# EasyEDA Pro project ProPrj_超级电容V1.1-正式版.epro, schematic Schematic1, sheets 1 to 3 of 8

## Sheets
1 电源: Create Date: 2024-03-25; Page Name: 电源; Project Name: 超级电容V1.1-正式版; Schematic Name: Schematic1; Update Date: 2024-04-20; Company: 嘉立创EDA; Drawed: Welt; Page Size: A4; Version: V1.0
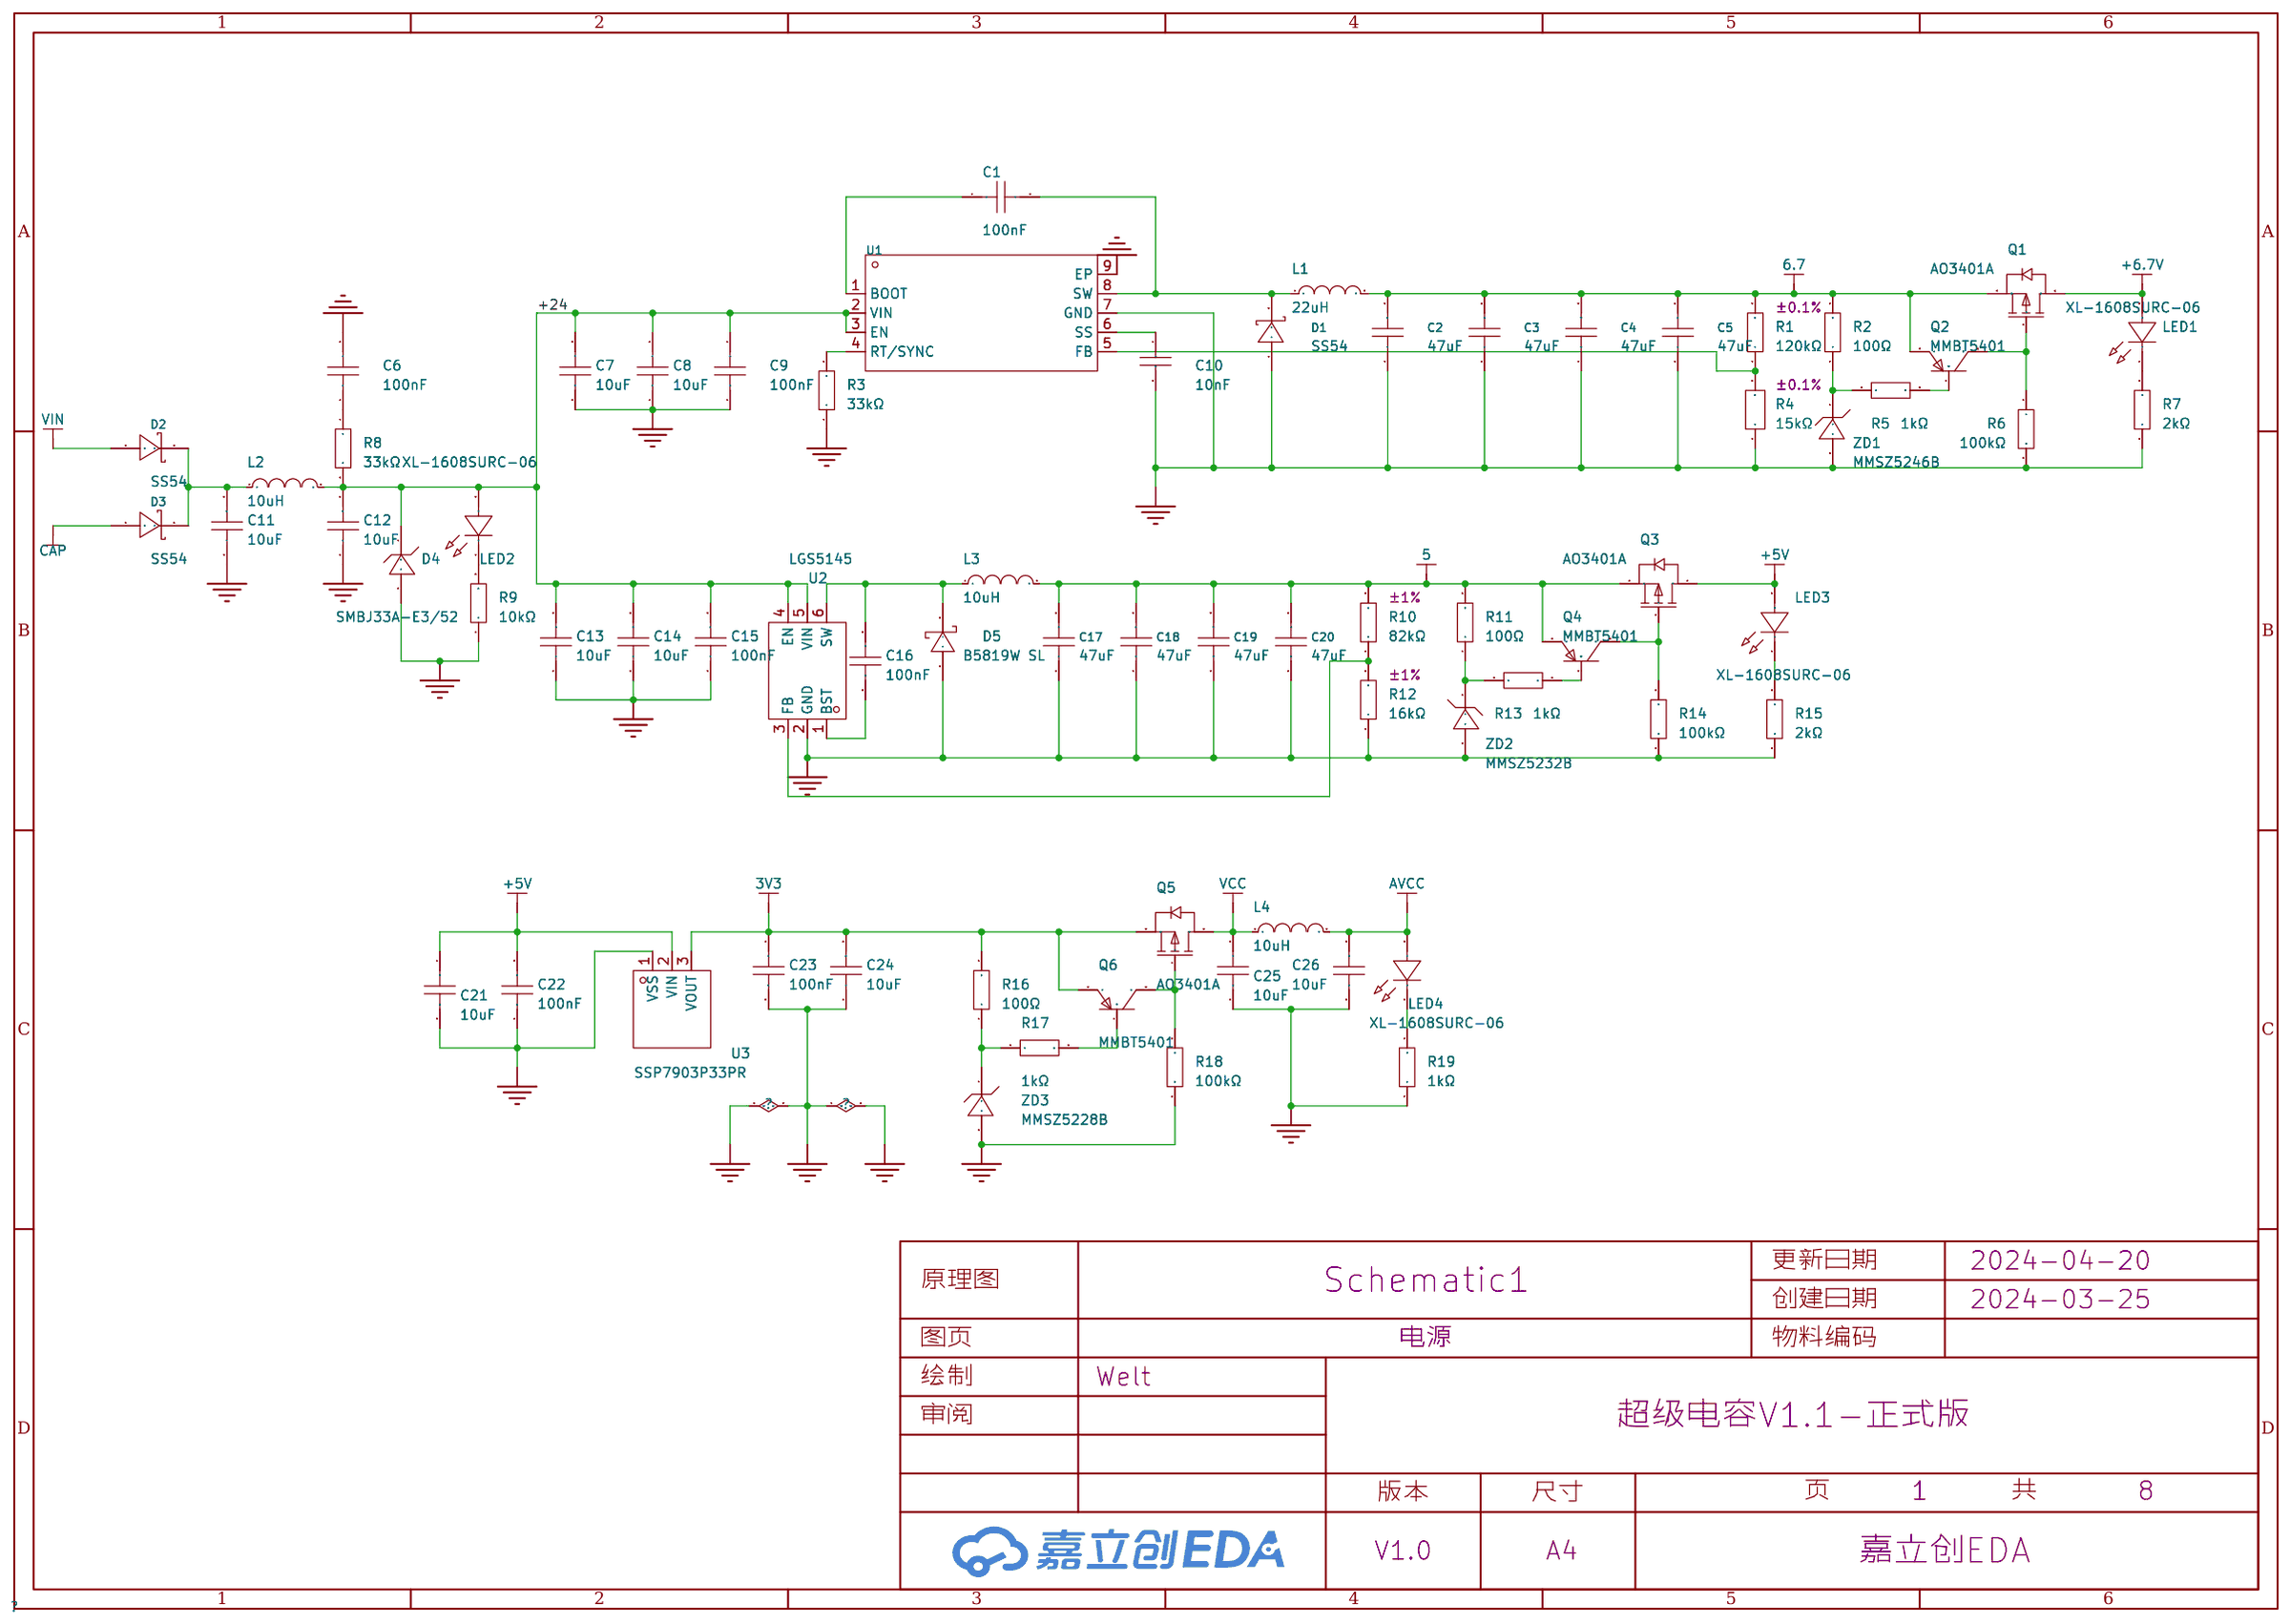
[diagram p0: 电源]
2 8708核心区: Page Name: 8708核心区; Project Name: 超级电容V1.0-样板; Update Date: 2024-04-18
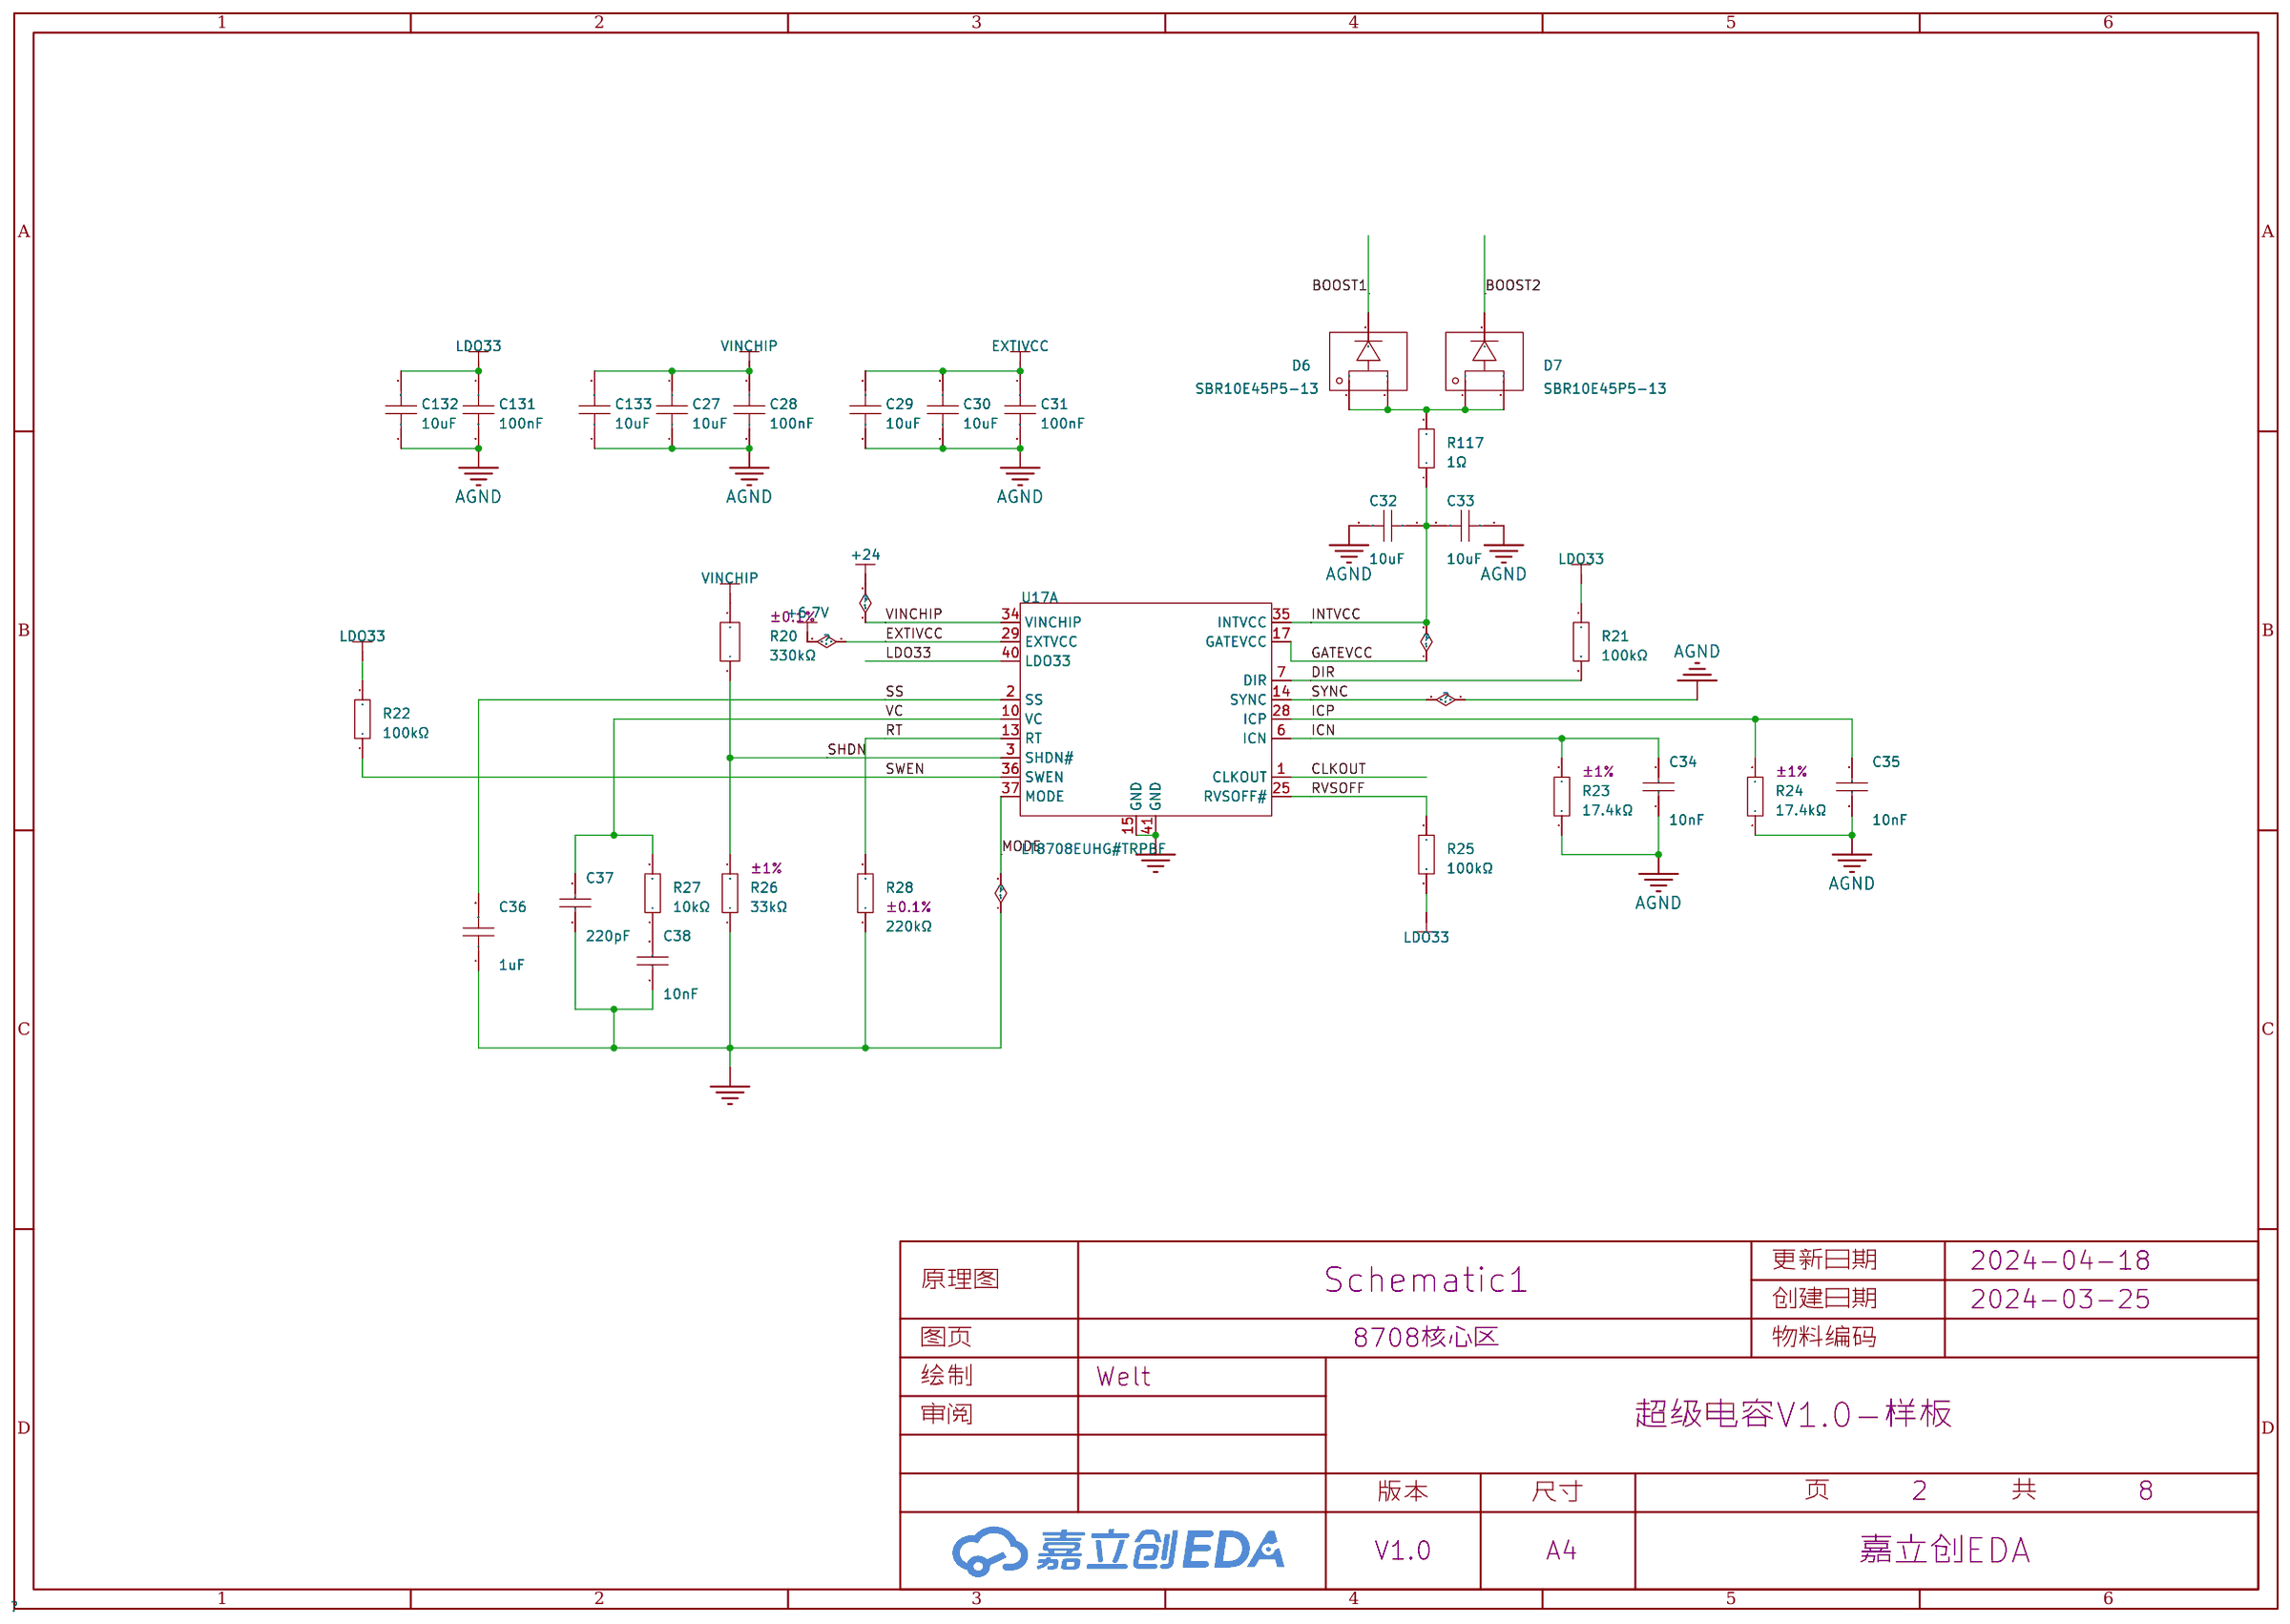
[diagram p1: 8708核心区]
3 功率通道: Page Name: 功率通道
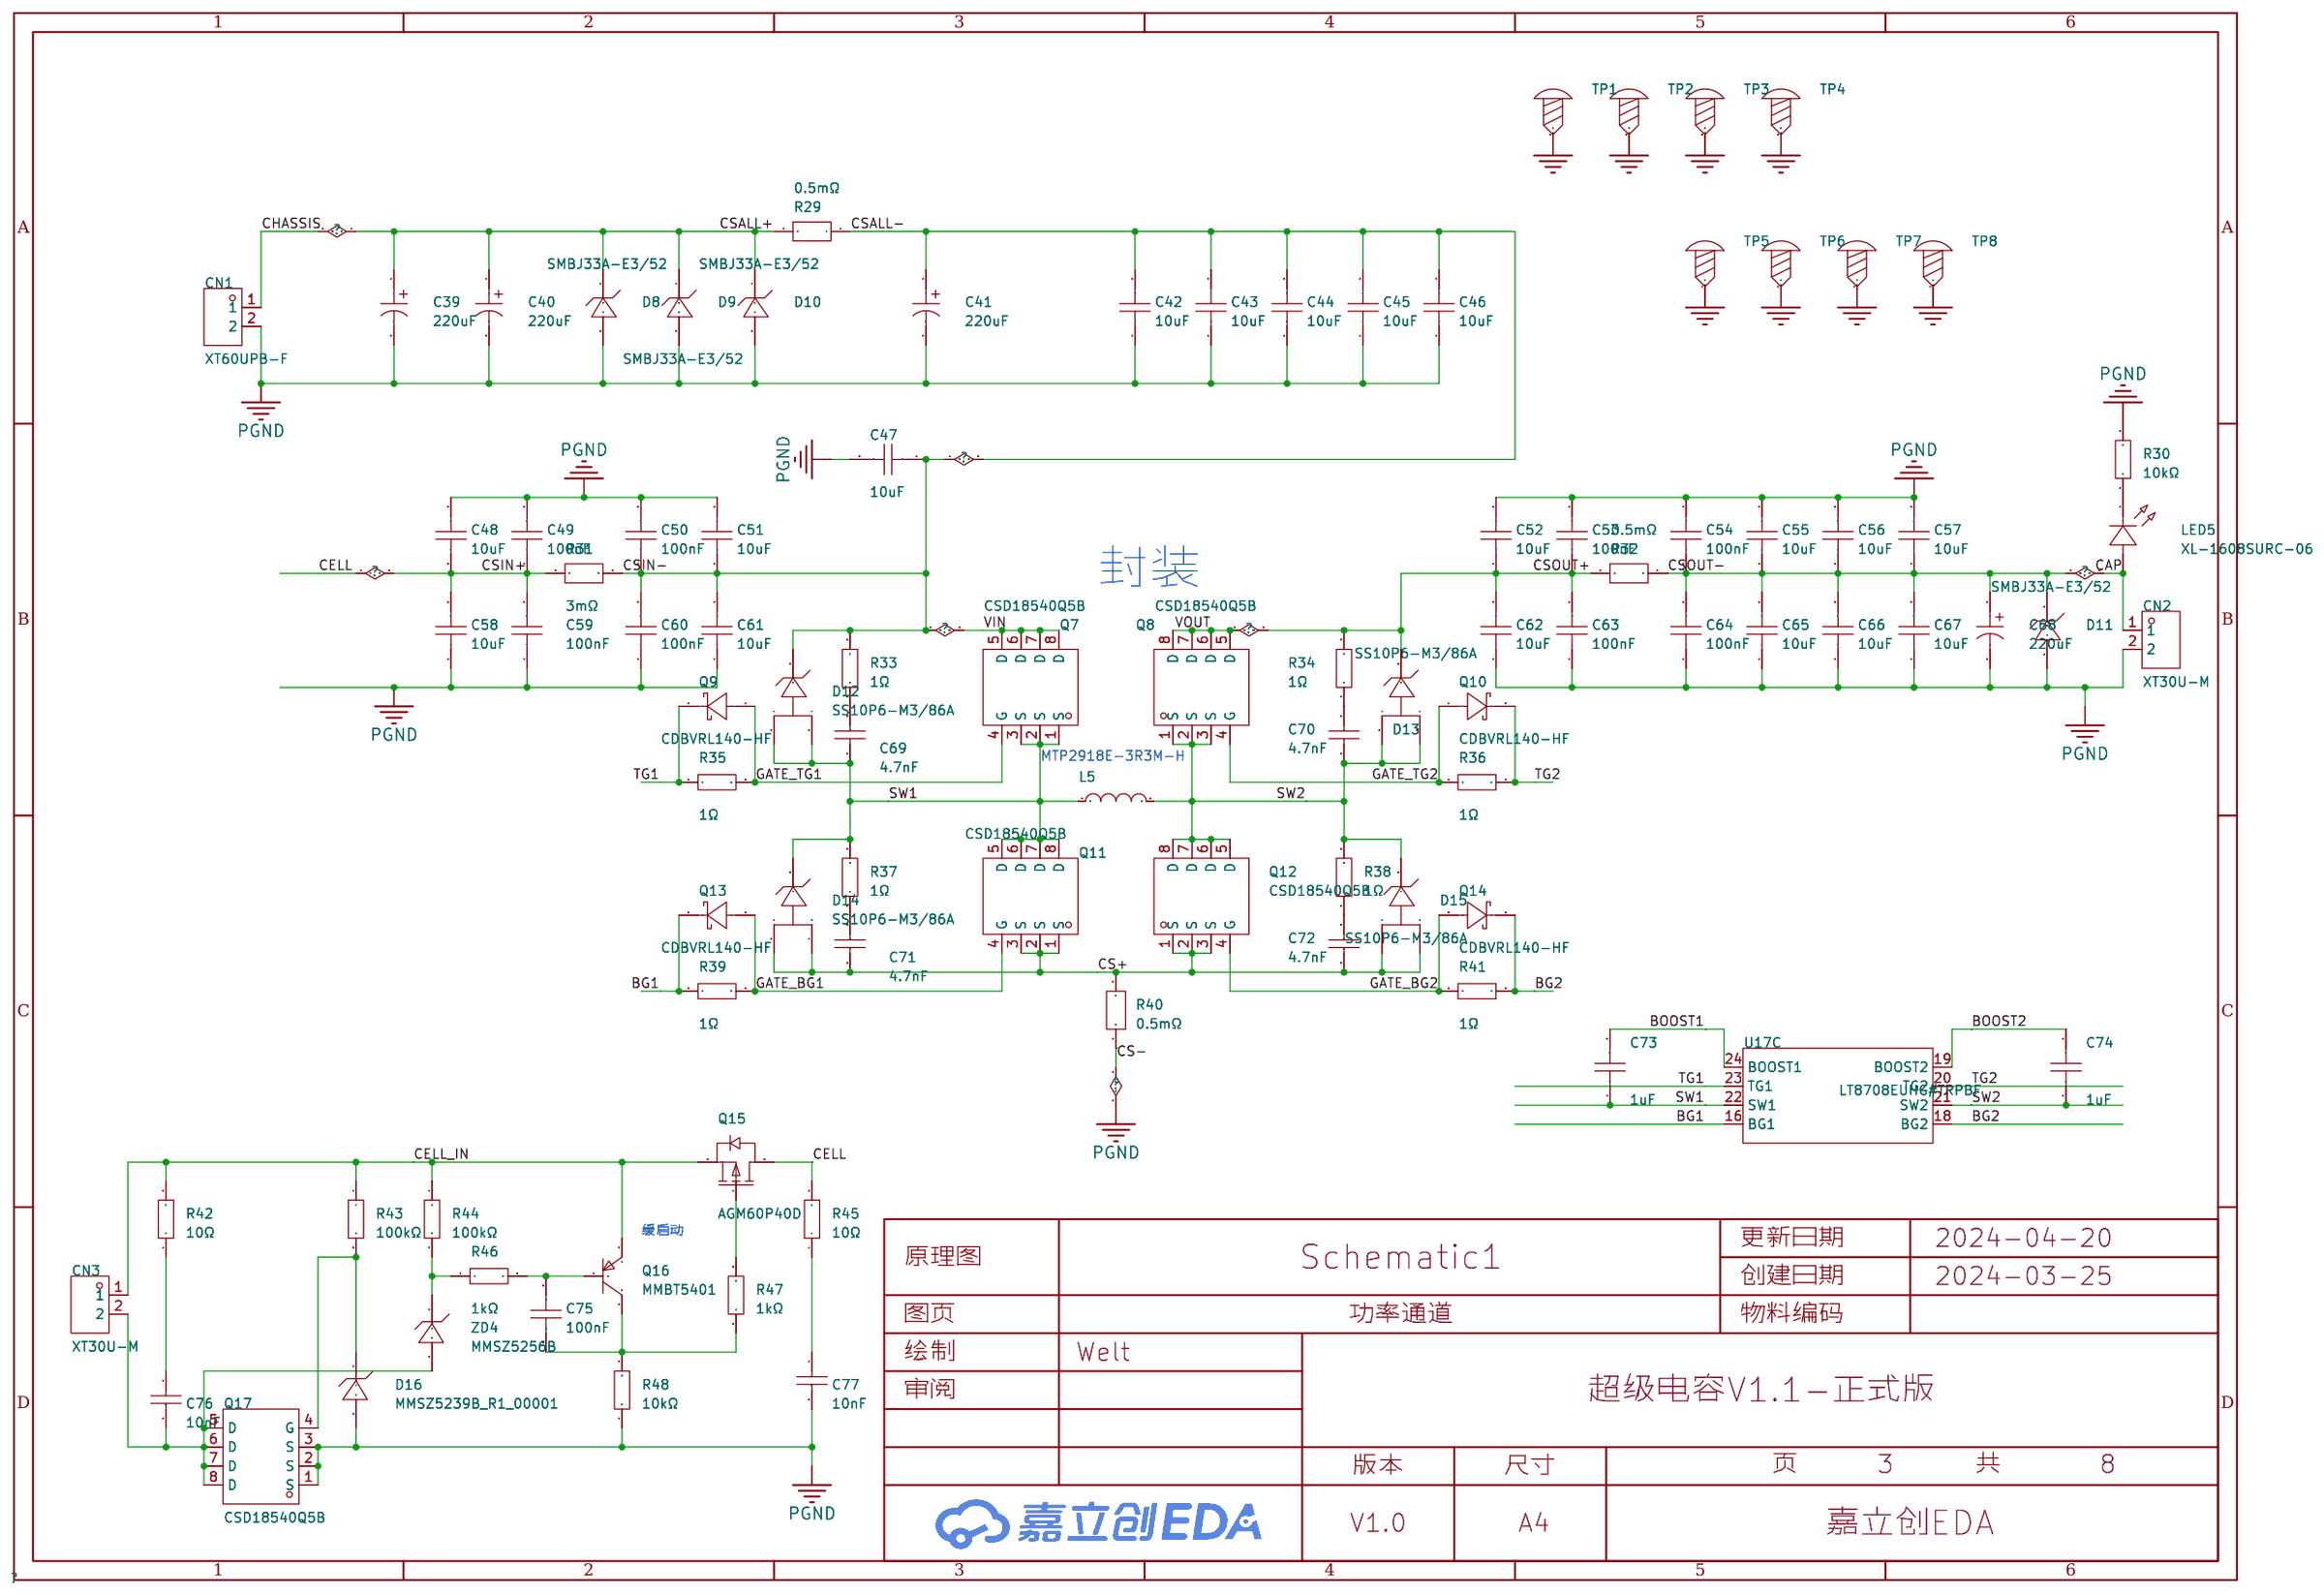
[diagram p2: 功率通道]

## Parts
sheet 8708核心区
C27  10uF  [0805电容-简化]
C28  100nF  [0603电容-简化]
C29  10uF  [0805电容-简化]
C30  10uF  [0805电容-简化]
C31  100nF  [0603电容-简化]
C32  10uF  [0805电容-简化]
C33  10uF  [0805电容-简化]
C34  10nF  [0603电容-简化]
C35  10nF  [0603电容-简化]
C36  1uF  [0603电容-简化]
C37  220pF  [0603电容-简化]
C38  10nF  [0603电容-简化]
C131  100nF  [0603电容-简化]
C132  10uF  [0805电容-简化]
C133  10uF  [0805电容-简化]
D6  SBR10E45P5-13  [POWERDI-5_L5.4-W4.0-LS6.5-RD]
D7  SBR10E45P5-13  [POWERDI-5_L5.4-W4.0-LS6.5-RD]
R20  330kΩ  [0603电阻-简化]
R21  100kΩ  [0603电阻-简化]
R22  100kΩ  [0603电阻-简化]
R23  17.4kΩ  [0603电阻-简化]
R24  17.4kΩ  [0603电阻-简化]
R25  100kΩ  [0603电阻-简化]
R26  33kΩ  [0603电阻-简化]
R27  10kΩ  [0603电阻-简化]
R28  220kΩ  [0603电阻-简化]
R117  1Ω  [0603电阻-简化]
U17  LT8708EUHG#TRPBF  [QFN-40_LT8708_Test]  (sections Center,Control,Power)
sheet 功率通道
C39  220uF  [CAP-TH_BD10.0-P5.00-D0.6-FD]
C40  220uF  [CAP-TH_BD10.0-P5.00-D0.6-FD]
C41  220uF  [CAP-TH_BD10.0-P5.00-D0.6-FD]
C42  10uF  [0805电容-简化]
C43  10uF  [0805电容-简化]
C44  10uF  [0805电容-简化]
C45  10uF  [0805电容-简化]
C46  10uF  [0805电容-简化]
C47  10uF  [0805电容-简化]
C48  10uF  [0805电容-简化]
C49  100nF  [0603电容-简化]
C50  100nF  [0603电容-简化]
C51  10uF  [0805电容-简化]
C52  10uF  [0805电容-简化]
C53  100nF  [0603电容-简化]
C54  100nF  [0603电容-简化]
C55  10uF  [0805电容-简化]
C56  10uF  [0805电容-简化]
C57  10uF  [0805电容-简化]
C58  10uF  [0805电容-简化]
C59  100nF  [0603电容-简化]
C60  100nF  [0603电容-简化]
C61  10uF  [0805电容-简化]
C62  10uF  [0805电容-简化]
C63  100nF  [0603电容-简化]
C64  100nF  [0603电容-简化]
C65  10uF  [0805电容-简化]
C66  10uF  [0805电容-简化]
C67  10uF  [0805电容-简化]
C68  220uF  [CAP-TH_BD10.0-P5.00-D0.6-FD]
C69  4.7nF  [0603电容-简化]
C70  4.7nF  [0603电容-简化]
C71  4.7nF  [0603电容-简化]
C72  4.7nF  [0603电容-简化]
C73  1uF  [0603电容-简化]
C74  1uF  [0603电容-简化]
C75  100nF  [0603电容-简化]
C76  10nF  [0603电容-简化]
C77  10nF  [0603电容-简化]
CN1  XT60UPB-F  [CONN-TH_XT60UPB-F]
CN2  XT30U-M  [CONN-TH_XT30U-M]
CN3  XT30U-M  [CONN-TH_XT30U-M]
D8  SMBJ33A-E3/52  [SMB_L4.3-W3.6-LS5.3-RD]
D9  SMBJ33A-E3/52  [SMB_L4.3-W3.6-LS5.3-RD]
D10  SMBJ33A-E3/52  [SMB_L4.3-W3.6-LS5.3-RD]
D11  SMBJ33A-E3/52  [SMB_L4.3-W3.6-LS5.3-RD]
D12  SS10P6-M3/86A  [TO-277A_L6.1-W4.6-P2.13-LS6.5-TR]
D13  SS10P6-M3/86A  [TO-277A_L6.1-W4.6-P2.13-LS6.5-TR]
D14  SS10P6-M3/86A  [TO-277A_L6.1-W4.6-P2.13-LS6.5-TR]
D15  SS10P6-M3/86A  [TO-277A_L6.1-W4.6-P2.13-LS6.5-TR]
D16  MMSZ5239B_R1_00001  [SOD-123F_L2.7-W1.6-LS3.8-RD-1]
L5  -  [VER2923-332KL]
LED5  XL-1608SURC-06  [LED0603-RD_RED]
Q7  CSD18540Q5B  [VSON-CLIP-8_L5.0-W6.0-P1.27-BL]
Q8  CSD18540Q5B  [VSON-CLIP-8_L5.0-W6.0-P1.27-BL]
Q9  CDBVRL140-HF  [LED-SMD_L1.6-W0.8-RD-2]
Q10  CDBVRL140-HF  [LED-SMD_L1.6-W0.8-RD-2]
Q11  CSD18540Q5B  [VSON-CLIP-8_L5.0-W6.0-P1.27-BL]
Q12  CSD18540Q5B  [VSON-CLIP-8_L5.0-W6.0-P1.27-BL]
Q13  CDBVRL140-HF  [LED-SMD_L1.6-W0.8-RD-2]
Q14  CDBVRL140-HF  [LED-SMD_L1.6-W0.8-RD-2]
Q15  AGM60P40D  [TO-252-3_L6.6-W6.1-P4.57-LS9.9-BR]
Q16  MMBT5401  [SOT-23-3_L2.9-W1.3-P1.90-LS2.4-BR]
Q17  CSD18540Q5B  [VSON-CLIP-8_L5.0-W6.0-P1.27-BL]
R29  0.5mΩ  [R2512]
R30  10kΩ  [0603电阻-简化]
R31  3mΩ  [R2512]
R32  0.5mΩ  [R2512]
R33  1Ω  [0603电阻-简化]
R34  1Ω  [0603电阻-简化]
R35  1Ω  [0603电阻-简化]
R36  1Ω  [0603电阻-简化]
R37  1Ω  [0603电阻-简化]
R38  1Ω  [0603电阻-简化]
R39  1Ω  [0603电阻-简化]
R40  0.5mΩ  [R2512]
R41  1Ω  [0603电阻-简化]
R42  10Ω  [0603电阻-简化]
R43  100kΩ  [0603电阻-简化]
R44  100kΩ  [0603电阻-简化]
R45  10Ω  [0603电阻-简化]
R46  1kΩ  [0603电阻-简化]
R47  1kΩ  [0603电阻-简化]
R48  10kΩ  [0603电阻-简化]
TP1  -  [M3泄压焊盘]
TP2  -  [M3泄压焊盘]
TP3  -  [M3泄压焊盘]
TP4  -  [M3泄压焊盘]
TP5  -  [M2.5泄压焊盘]
TP6  -  [M2.5泄压焊盘]
TP7  -  [M2.5泄压焊盘]
TP8  -  [M2.5泄压焊盘]
ZD4  MMSZ5256B  [SOD-123_L2.8-W1.8-LS3.7-RD]
sheet 电源
C1  100nF  [0603电容-简化]
C2  47uF  [1206电容-简化]
C3  47uF  [1206电容-简化]
C4  47uF  [1206电容-简化]
C5  47uF  [1206电容-简化]
C6  100nF  [0603电容-简化]
C7  10uF  [0805电容-简化]
C8  10uF  [0805电容-简化]
C9  100nF  [0603电容-简化]
C10  10nF  [0603电容-简化]
C11  10uF  [0805电容-简化]
C12  10uF  [0805电容-简化]
C13  10uF  [0805电容-简化]
C14  10uF  [0805电容-简化]
C15  100nF  [0603电容-简化]
C16  100nF  [0603电容-简化]
C17  47uF  [1206电容-简化]
C18  47uF  [1206电容-简化]
C19  47uF  [1206电容-简化]
C20  47uF  [1206电容-简化]
C21  10uF  [0805电容-简化]
C22  100nF  [0603电容-简化]
C23  100nF  [0603电容-简化]
C24  10uF  [0805电容-简化]
C25  10uF  [0805电容-简化]
C26  10uF  [0805电容-简化]
D1  SS54  [SMA_L4.4-W2.8-LS5.4-R-RD]
D2  SS54  [SMA_L4.4-W2.8-LS5.4-R-RD]
D3  SS54  [SMA_L4.4-W2.8-LS5.4-R-RD]
D4  SMBJ33A-E3/52  [SMB_L4.3-W3.6-LS5.3-RD]
D5  B5819W SL  [SOD-123_L2.7-W1.6-LS3.7-RD-1]
L1  22uH  [IND-SMD_L4.5-W4.1_SRP4020TA]
L2  10uH  [0603磁珠-简化]
L3  10uH  [IND-SMD_L2.5-W2.0_SWPA252012S]
L4  10uH  [0603磁珠-简化]
LED1  XL-1608SURC-06  [LED0603-RD_RED]
LED2  XL-1608SURC-06  [LED0603-RD_RED]
LED3  XL-1608SURC-06  [LED0603-RD_RED]
LED4  XL-1608SURC-06  [LED0603-RD_RED]
Q1  AO3401A  [SOT-23_L2.9-W1.3-P1.90-LS2.4-BR]
Q2  MMBT5401  [SOT-23-3_L2.9-W1.3-P1.90-LS2.4-BR]
Q3  AO3401A  [SOT-23_L2.9-W1.3-P1.90-LS2.4-BR]
Q4  MMBT5401  [SOT-23-3_L2.9-W1.3-P1.90-LS2.4-BR]
Q5  AO3401A  [SOT-23_L2.9-W1.3-P1.90-LS2.4-BR]
Q6  MMBT5401  [SOT-23-3_L2.9-W1.3-P1.90-LS2.4-BR]
R1  120kΩ  [0603电阻-简化]
R2  100Ω  [0603电阻-简化]
R3  33kΩ  [0603电阻-简化]
R4  15kΩ  [0603电阻-简化]
R5  1kΩ  [0603电阻-简化]
R6  100kΩ  [0603电阻-简化]
R7  2kΩ  [0603电阻-简化]
R8  33kΩ  [0603电阻-简化]
R9  10kΩ  [0603电阻-简化]
R10  82kΩ  [0603电阻-简化]
R11  100Ω  [0603电阻-简化]
R12  16kΩ  [0603电阻-简化]
R13  1kΩ  [0603电阻-简化]
R14  100kΩ  [0603电阻-简化]
R15  2kΩ  [0603电阻-简化]
R16  100Ω  [0603电阻-简化]
R17  1kΩ  [0603电阻-简化]
R18  100kΩ  [0603电阻-简化]
R19  1kΩ  [0603电阻-简化]
U1  LMR14050SDDAR  [SOIC-8_L4.9-W3.9-P1.27-LS6.0-BL-EP]
U2  LGS5145  [SOT-23-6_L2.9-W1.7-P0.95-LS2.8-BL]
U3  SSP7903P33PR  [SOT-89-3_L4.5-W2.5-P1.50-LS4.1-BR]
ZD1  MMSZ5246B  [SOD-123_L2.8-W1.8-LS3.7-RD]
ZD2  MMSZ5232B  [SOD-123_L2.8-W1.8-LS3.7-RD]
ZD3  MMSZ5228B  [SOD-123_L2.8-W1.8-LS3.7-RD]

## Library data of the parts
C7 C8 C11-C14 C21 C24-C27 C29 C30 C32 C33 C42-C48 C51 C52 C55-C58 C61 C62 C65-C67 C132 C133 = CL21A106KBYQNNE: 容值:10uF;精度:±10%;额定电压:50V;材质(温度系数):X5R;; LCSC Part Name: 10uF ±10% 50V; Supplier Part: C2932476; Manufacturer: SAMSUNG(三星); Supplier Footprint: 0805; JLCPCB Part Class: 扩展库; Datasheet: https://atta.szlcsc.com/upload/public/pdf/source/20211217/EA547804C3DC63CB0E92325AB8B6CF61.pdf; Supplier: LCSC; Tolerance: ±10%; Voltage Rated: 50V; Temperature Coefficient: X5R
C1 C6 C9 C15 C16 C22 C23 C28 C31 C49 C50 C53 C54 C59 C60 C63 C64 C75 C131 = CC0603KRX7R9BB104: 容值:100nF;精度:±10%;额定电压:50V;材质(温度系数):X7R;; LCSC Part Name: 100nF ±10% 50V; Supplier Part: C14663; Manufacturer: YAGEO(国巨); Supplier Footprint: 0603; JLCPCB Part Class: 基础库; Datasheet: https://atta.szlcsc.com/upload/public/pdf/source/20180910/C282072_33301C7F631E79921B82A8DAC6BCC5B3.pdf; Supplier: LCSC; Tolerance: ±10%; Voltage Rated: 50V; Temperature Coefficient: X7R
C10 C34 C35 C38 C76 C77 = CC0603KRX7R9BB103: 容值:10nF;精度:±10%;额定电压:50V;材质(温度系数):X7R;; LCSC Part Name: 10nF ±10% 50V; Supplier Part: C100042; Manufacturer: YAGEO(国巨); Supplier Footprint: 0603; JLCPCB Part Class: 扩展库; Datasheet: https://atta.szlcsc.com/upload/public/pdf/source/20180326/C100042_E8B0111D51DE3671A0A4A59FBCEFE81C.pdf; Supplier: LCSC; Tolerance: ±10%; Voltage Rated: 50V; Temperature Coefficient: X7R
C36 C73 C74 = CC0603KRX7R9BB105: 容值:1uF;精度:±10%;额定电压:50V;材质(温度系数):X7R;; LCSC Part Name: 1uF ±10% 50V; Supplier Part: C559769; Manufacturer: YAGEO(国巨); Supplier Footprint: 0603; JLCPCB Part Class: 扩展库; Datasheet: https://atta.szlcsc.com/upload/public/pdf/source/20181031/C325451_C7CF01155AE3010E0D610C52F5FE7D31.pdf; Supplier: LCSC; Tolerance: ±10%; Voltage Rated: 50V; Temperature Coefficient: X7R
C37 = CC0603KRX7R9BB221: 容值:220pF;精度:±10%;额定电压:50V;材质(温度系数):X7R;; LCSC Part Name: 220pF ±10% 50V; Supplier Part: C107081; Manufacturer: YAGEO(国巨); Supplier Footprint: 0603; JLCPCB Part Class: 扩展库; Datasheet: https://atta.szlcsc.com/upload/public/pdf/source/20170420/1492670715328.pdf; Supplier: LCSC; Tolerance: ±10%; Voltage Rated: 50V; Temperature Coefficient: X7R
D6 D7 = SBR10E45P5-13: 二极管配置:-;正向压降(Vf):420mV@10A;直流反向耐压(Vr):45V;平均整流电流(Io):10A;; LCSC Part Name: 电压:45V 电流:10A; Supplier Part: C73567; Manufacturer: DIODES(美台); Supplier Footprint: Power-DI-5; JLCPCB Part Class: 扩展库; Datasheet: https://atta.szlcsc.com/upload/public/pdf/source/20181015/C73567_6225E6E34C6EFB26742F8B8A5F78C84A.pdf; Supplier: LCSC; Forward Voltage (Vf) @ If: 420mV@10A; Reverse Voltage (Vr): 45V; Average Rectified Current (Io): 10A; Reverse Leakage Current: 50uA@45V
R20 = TC0325B3303T5F: 电阻类型:薄膜电阻;阻值:330kΩ;精度:±0.1%;功率:100mW;最大工作电压:75V;温度系数:±25ppm/℃;; LCSC Part Name: 330kΩ ±0.1% 100mW 薄膜电阻; Supplier Part: C2989388; Manufacturer: UNI-ROYAL(厚声); Supplier Footprint: 0603; JLCPCB Part Class: Extended Part; Datasheet: https://atta.szlcsc.com/upload/public/pdf/source/20220708/6ACD1707201702E70C0F417A19EB926E.pdf; Supplier: LCSC; Type: 薄膜电阻; Tolerance: ±0.1%; Power(Watts): 100mW; Overload Voltage (Max): 75V; Temperature Coefficient: ±25ppm/℃
R6 R14 R18 R21 R22 R25 R43 R44 = RC0603FR-07100KL: 电阻类型:厚膜电阻;阻值:100kΩ;精度:±1%;功率:100mW;温度系数:±100ppm/℃;; LCSC Part Name: 厚膜电阻 100kΩ ±1% 100mW; Supplier Part: C14675; Manufacturer: YAGEO(国巨); Supplier Footprint: 0603; JLCPCB Part Class: 扩展库; Datasheet: https://atta.szlcsc.com/upload/public/pdf/source/20140324/1457707028752.pdf; Supplier: LCSC; Type: 厚膜电阻; Tolerance: ±1%; Power(Watts): 100mW; Temperature Coefficient: ±100ppm/℃; Overload Voltage (Max): 75V; Operating Temperature Range: -55℃~+155℃
R23 R24 = AC0603FR-0717K4L: 电阻类型:厚膜电阻;阻值:17.4kΩ;精度:±1%;功率:100mW;; LCSC Part Name: 17.4kΩ ±1% 100mW; Supplier Part: C227623; Manufacturer: YAGEO(国巨); Supplier Footprint: 0603; JLCPCB Part Class: Extended Part; Datasheet: https://atta.szlcsc.com/upload/public/pdf/source/20181114/C227623_B2FF746DEED2EAB4D0145F68429B14CA.pdf; Supplier: LCSC; Type: 厚膜电阻; Tolerance: ±1%; Power(Watts): 100mW; Temperature Coefficient: ±100ppm/℃; Overload Voltage (Max): 75V; Operating Temperature Range: -55℃~+155℃
R3 R8 R26 = 0603WAF3302T5E: 阻值:33kΩ;精度:±1%;功率:100mW;温度系数:±100ppm/℃;电阻类型:厚膜电阻;; LCSC Part Name: 33kΩ ±1% 100mW 厚膜电阻; Supplier Part: C4216; Manufacturer: UNI-ROYAL(厚声); Supplier Footprint: 0603; JLCPCB Part Class: Basic Part; Datasheet: https://atta.szlcsc.com/upload/public/pdf/source/20200306/C422600_1E6D84923E4A46A82E41ADD87F860B5C.pdf; Supplier: LCSC; Tolerance: ±1%; Power(Watts): 100mW; Overload Voltage (Max): 75V; Temperature Coefficient: ±100ppm/℃; Type: 厚膜电阻; Operating Temperature Range: -55℃~+155℃
R9 R27 R30 R48 = RC0603FR-0710KL: 电阻类型:厚膜电阻;阻值:10kΩ;精度:±1%;功率:100mW;; LCSC Part Name: 10kΩ ±1% 100mW; Supplier Part: C98220; Manufacturer: YAGEO(国巨); Supplier Footprint: 0603; JLCPCB Part Class: 扩展库; Datasheet: https://atta.szlcsc.com/upload/public/pdf/source/20170522/1495423494387.pdf; Supplier: LCSC; Type: 厚膜电阻; Tolerance: ±1%; Power(Watts): 100mW; Temperature Coefficient: ±100ppm/℃; Overload Voltage (Max): 75V; Operating Temperature Range: -55℃~+155℃
R28 = RT0603BRE07220KL: 电阻类型:薄膜电阻;阻值:220kΩ;精度:±0.1%;功率:100mW;最大工作电压:75V;温度系数:±50ppm/℃;; LCSC Part Name: 薄膜电阻 220kΩ ±0.1% 100mW; Supplier Part: C326764; Manufacturer: YAGEO(国巨); Supplier Footprint: 0603; JLCPCB Part Class: Extended Part; Datasheet: https://atta.szlcsc.com/upload/public/pdf/source/20181031/C326764_D76B712FE3A4847E5BBB2C2C7C178CED.pdf; Supplier: LCSC; Type: 薄膜电阻; Tolerance: ±0.1%; Power(Watts): 100mW; Overload Voltage (Max): 75V; Temperature Coefficient: ±50ppm/℃; Operating Temperature Range: -55℃~+155℃
R33-R39 R41 R117 = RC0603FR-071RL: 电阻类型:厚膜电阻;阻值:1Ω;精度:±1%;功率:100mW;最大工作电压:75V;温度系数:±200ppm/℃;; LCSC Part Name: 厚膜电阻 1Ω ±1% 100mW; Supplier Part: C112305; Manufacturer: YAGEO(国巨); Supplier Footprint: 0603; JLCPCB Part Class: Extended Part; Datasheet: https://atta.szlcsc.com/upload/public/pdf/source/20230412/AFDB764CF169FCD02397F47E2BB81F5A.pdf; Supplier: LCSC; Type: 厚膜电阻; Tolerance: ±1%; Power(Watts): 100mW; Overload Voltage (Max): 75V; Temperature Coefficient: ±200ppm/℃; Operating Temperature Range: -55℃~+155℃
U17 = LT8708EUHG#TRPBF: 功能类型:升降压型;同步整流:是;输出通道数:1;拓扑结构:升降压式;输入电压:2.8V~80V;开关频率:400kHz;占空比(最大值):80%;工作温度:-40℃~+125℃;; LCSC Part Name: 升降压型 2.8V~80V 400kHz; Supplier Part: C2658801; Manufacturer: ADI(亚德诺)/LINEAR; Supplier Footprint: QFN-40(5x8); JLCPCB Part Class: 扩展库; Datasheet: https://atta.szlcsc.com/upload/public/pdf/source/20210601/0A4036ACA6D5292E858C905D6C703EE3.pdf; Supplier: LCSC; Function: 升降压型; Synchronous Rectification: 是; Number of Outputs: 1; Topology: 升降压式; Input Voltage: 2.8V~80V; Switching Frequency: 400kHz; Duty Cycle (Max): 80%; Operating Temperature: -40℃~+125℃; Check: false
C39-C41 C68 = SPZ1HM221G12O00RAXXX: 容值:220uF;精度:±20%;额定电压:50V;纹波电流:-;等效串联电阻:-;类型:-;; LCSC Part Name: 220uF ±20% 50V; Supplier Part: C2691846; Manufacturer: AISHI(艾华集团); Supplier Footprint: 插件,D10xL12mm; JLCPCB Part Class: Extended Part; Datasheet: https://atta.szlcsc.com/upload/public/pdf/source/20180906/C160181_A9A2ACDA3CC278FCDBAF747E681A6DA5.pdf; Supplier: LCSC; Tolerance: ±20%; Rated Voltage: 50V
C69-C72 = CC0603KRX7R9BB472: 容值:4.7nF;精度:±10%;额定电压:50V;材质(温度系数):X7R;; LCSC Part Name: 4.7nF ±10% 50V; Supplier Part: C106218; Manufacturer: YAGEO(国巨); Supplier Footprint: 0603; JLCPCB Part Class: 扩展库; Datasheet: https://atta.szlcsc.com/upload/public/pdf/source/20180910/C282072_33301C7F631E79921B82A8DAC6BCC5B3.pdf; Supplier: LCSC; Tolerance: ±10%; Voltage Rated: 50V; Temperature Coefficient: X7R
CN1 = XT60UPB-F: Supplier Part: C9900007500; Supplier Footprint: 插件; JLCPCB Part Class: 扩展库; Datasheet: https://atta.szlcsc.comnull; Supplier: LCSC
CN2 CN3 = XT30U-M: 类别:-;类型1:-;; LCSC Part Name: AMASS(艾迈斯)轻量版锂电池插头公头 XT30U-M; Supplier Part: C99101; Manufacturer: AMASS(艾迈斯); JLCPCB Part Class: Extended Part; Datasheet: https://atta.szlcsc.com/upload/public/pdf/source/20170606/1496716542582.pdf; Supplier: LCSC; Brand: 艾迈斯; Type: 插头; Colour: 黄色; InterfaceType: 公头
D4 D8-D11 = SMBJ33A-E3/52: 极性:单向;反向截止电压(Vrwm):33V;击穿电压(最小值):36.7V;峰值脉冲电流(Ipp)@10/1000μs:-;最大钳位电压:53.3V;峰值脉冲功率(Ppp)@10/1000μs:600W;; LCSC Part Name: 单向 Vrwm:33V 600W; Supplier Part: C435842; Manufacturer: VISHAY(威世); Supplier Footprint: SMB; JLCPCB Part Class: 扩展库; Datasheet: https://atta.szlcsc.com/upload/public/pdf/source/20191009/C435842_A3AC3DDCF65F80BE3580F2A5F1880473.pdf; Supplier: LCSC; Polarity: 单向; Reverse Stand-Off Voltage (Vrwm): 33V; Breakdown Voltage (Min): 36.7V; Maximum Clamping Voltage: 53.3V; Peak Pulse Power Dissipation (Ppp)@10/1000μs: 600W
D12-D15 = SS10P6-M3/86A: 二极管配置:独立式;正向压降(Vf):590mV@10A;直流反向耐压(Vr):60V;平均整流电流(Io):10A;; LCSC Part Name: 电压:60V 电流:10A; Supplier Part: C2927414; Manufacturer: VISHAY(威世); Supplier Footprint: TO-277A; JLCPCB Part Class: Extended Part; Datasheet: https://atta.szlcsc.com/upload/public/pdf/source/20211203/A4FEEE62CD390BD3C907290EA7E2981B.pdf; Supplier: LCSC; Diode Configuration: 独立式; Forward Voltage (Vf@If): 590mV@10A; Reverse Voltage (Vr): 60V; Average Rectified Current (Io): 10A; Reverse Leakage Current (Ir): 7.8uA@60V
D16 = MMSZ5239B_R1_00001: 二极管配置:独立式;稳压值(标称值):9.1V;稳压值(范围):8.65V~9.56V;功率:500mW;精度:±5%;; Supplier Part: C268600; Manufacturer: PANJIT(强茂); Supplier Footprint: SOD-123; JLCPCB Part Class: Extended Part; Datasheet: https://atta.szlcsc.com/upload/public/pdf/source/20190416/C268600_667F1AA345ACCDA25AE5EE15885475AA.pdf; Supplier: LCSC; Diode Configuration: 独立式; Zener Voltage (Nom): 9.1V; Reverse Leakage Current (Ir): 3uA@6.5V; Zener Voltage (Range): 8.65V~9.56V; Power Dissipation: 500mW; Zener Impedance (Zzt): 10Ω; Tolerance: ±5%
L5 = VER2923-332KL
LED1-LED5 = XL-1608SURC-06: 发光颜色:红灯;主波长:617nm~621nm;色温:-;功率:55mW;安装方式:正贴;; LCSC Part Name: 红灯 正贴; Supplier Part: C965799; Manufacturer: XINGLIGHT(成兴光); Supplier Footprint: 0603; JLCPCB Part Class: 扩展库; Datasheet: https://atta.szlcsc.com/upload/public/pdf/source/20221102/D860AFDD1CDB02C5A8064103A32707E2.pdf; Supplier: LCSC; Emitted Color: 红灯; Lens Color: 无色透明; Dominant Wavelength: 617nm~621nm; Peak Wavelength: 623nm; Forward Current: 25mA; Power Dissipation: 55mW; Viewing Angle: 120°; Mounting Sytle: 正贴; Operating Temperature: -30℃~+85℃
Q7 Q8 Q11 Q12 Q17 = CSD18540Q5B: 类型:N沟道;漏源电压(Vdss):60V;连续漏极电流(Id):100A;功率(Pd):3.1W；195W;导通电阻(RDS(on)@Vgs,Id):2.2mΩ@10V,28A;阈值电压(Vgs(th)@Id):2.3V@250uA;; LCSC Part Name: N沟道 耐压:60V 电流:100A; Supplier Part: C86513; Manufacturer: TI(德州仪器); Supplier Footprint: VSON-8(5x6); JLCPCB Part Class: 扩展库; Datasheet: https://www.ti.com/cn/lit/gpn/csd18540q5b; Supplier: LCSC; Type: N沟道; Drain Source Voltage (Vdss): 60V; Continuous Drain Current (Id): 100A; Power Dissipation (Pd): 3.1W；195W; Drain Source On Resistance (RDS(on)@Vgs,Id): 2.2mΩ@10V,28A; Gate Threshold Voltage (Vgs(th)@Id): 2.3V@250uA; Total Gate Charge (Qg@Vgs): 53nC@10V; Input Capacitance (Ciss@Vds): 4.23nF@30V; Operating Temperature: -55℃~+150℃@(Tj)
Q9 Q10 Q13 Q14 = CDBVRL140-HF: 正向压降(Vf):550mV@700mA;直流反向耐压(Vr):40V;平均整流电流(Io):1A;; LCSC Part Name: 电压:40V 电流:1A; Supplier Part: C3758192; Manufacturer: Comchip(典琦); Supplier Footprint: 0603; JLCPCB Part Class: Extended Part; Datasheet: https://atta.szlcsc.com/upload/public/pdf/source/20240116/3D60EEEEF0718EF97C1BF0B00CBFA01B.pdf; Supplier: LCSC; Forward Voltage (Vf@If): 550mV@700mA; Reverse Voltage (Vr): 40V; Average Rectified Current (Io): 1A; Reverse Leakage Current (Ir): 50uA@40V
Q15 = AGM60P40D: 类型:P沟道;漏源电压(Vdss):60V;连续漏极电流(Id):45A;功率(Pd):52W;导通电阻(RDS(on)@Vgs,Id):5.7mΩ@10V,20A;阈值电压(Vgs(th)@Id):2.2V@250uA;; LCSC Part Name: P沟道 耐压:60V 电流:45A; Supplier Part: C5184850; Manufacturer: AGM-Semi(芯控源); Supplier Footprint: TO-252; JLCPCB Part Class: 扩展库; Datasheet: https://atta.szlcsc.com/upload/public/pdf/source/20220929/C0F9F9675AC61700DE36EE67C983C46C.pdf; Supplier: LCSC; Type: P沟道; Drain Source Voltage (Vdss): 60V; Continuous Drain Current (Id): 45A; Power Dissipation (Pd): 52W; Drain Source On Resistance (RDS(on)@Vgs,Id): 5.7mΩ@10V,20A; Gate Threshold Voltage (Vgs(th)@Id): 2.2V@250uA; Total Gate Charge (Qg@Vgs): 5.7nC@10V; Operating Temperature: -55℃~+150℃@(Tj)
Q2 Q4 Q6 Q16 = MMBT5401_C8326: 晶体管类型:PNP;集射极击穿电压(Vceo):150V;集电极电流(Ic):600mA;功率(Pd):300mW;集电极截止电流(Icbo):100nA;集电极-发射极饱和电压(VCE(sat)@Ic,Ib):500mV@50mA,5mA;直流电流增益(hFE@Ic,Vce):200@10mA,5V;特征频率(fT):100MHz;工作温度:+150℃@(Tj);; LCSC Part Name: PNP 150V 600mA; Supplier Part: C8326; Manufacturer: CJ(江苏长电/长晶); Supplier Footprint: SOT-23; JLCPCB Part Class: 基础库; Datasheet: https://atta.szlcsc.com/upload/public/pdf/source/20140809/1457707213644.pdf; Supplier: LCSC; Transistor Type: PNP; Collector-Emitter Breakdown Voltage (Vceo): 150V; Collector Current (Ic): 600mA; Power Dissipation (Pd): 300mW; Collector Cut-Off Current (Icbo): 100nA; Collector-Emitter Saturation Voltage (VCE(sat)@Ic,Ib): 500mV@50mA,5mA; DC Current Gain (hFE@Ic,Vce): 200@10mA,5V; Transition Frequency (fT): 100MHz; Operating Temperature: +150℃@(Tj)
R29 R32 R40 = PA2512FKF7T0U5E: 电阻类型:-;阻值:0.5mΩ;精度:±1%;功率:3W;; LCSC Part Name: 0.5mΩ ±1% 3W; Supplier Part: C728336; Manufacturer: YAGEO(国巨); Supplier Footprint: 2512; JLCPCB Part Class: Extended Part; Datasheet: https://atta.szlcsc.com/upload/public/pdf/source/20200824/C728336_09DD2DC566A38186C304AC5F0741C8D9.pdf; Supplier: LCSC; Tolerance: ±1%; Power(Watts): 3W; Temperature Coefficient: ±100ppm/℃; Operating Temperature Range: -55℃~+170℃
R31 = LR2512D-3W-3mR-1%: 电阻类型:采样电阻;阻值:3mΩ;精度:±1%;功率:3W;温度系数:25ppm/℃~+50ppm/℃;安装方式:贴片;; LCSC Part Name: 3mΩ ±1% 3W; Supplier Part: C500737; Manufacturer: Milliohm(毫欧); Supplier Footprint: 2512; JLCPCB Part Class: Extended Part; Datasheet: https://atta.szlcsc.com/upload/public/pdf/source/20211008/27BCB003066C6550DC06C87D8395239C.pdf; Supplier: LCSC; Type: 采样电阻; Tolerance: ±1%; Power(Watts): 3W; Temperature Coefficient: 25ppm/℃~+50ppm/℃; Mounting Sytle: 贴片
R42 R45 = AC0603FR-0710RL: 电阻类型:厚膜电阻;阻值:10Ω;精度:±1%;功率:100mW;; LCSC Part Name: 10Ω ±1% 100mW; Supplier Part: C138286; Manufacturer: YAGEO(国巨); Supplier Footprint: 0603; JLCPCB Part Class: 扩展库; Datasheet: https://atta.szlcsc.com/upload/public/pdf/source/20171225/C138286_15141879483321202848.pdf; Supplier: LCSC; Type: 厚膜电阻; Tolerance: ±1%; Power(Watts): 100mW; Temperature Coefficient: ±200ppm/℃; Overload Voltage (Max): 75V; Operating Temperature Range: -55℃~+155℃
R5 R13 R17 R19 R46 R47 = 0603WAF1001T5E: 阻值:1kΩ;精度:±1%;功率:100mW;温度系数:±100ppm/℃;电阻类型:厚膜电阻;; LCSC Part Name: 1kΩ ±1% 100mW 厚膜电阻; Supplier Part: C21190; Manufacturer: UNI-ROYAL(厚声); Supplier Footprint: 0603; JLCPCB Part Class: Basic Part; Datasheet: https://atta.szlcsc.com/upload/public/pdf/source/20200306/C422600_1E6D84923E4A46A82E41ADD87F860B5C.pdf; Supplier: LCSC; Tolerance: ±1%; Power(Watts): 100mW; Overload Voltage (Max): 75V; Temperature Coefficient: ±100ppm/℃; Type: 厚膜电阻; Operating Temperature Range: -55℃~+155℃
TP1-TP4 = M3螺丝: Supplier Footprint: 插件
TP5-TP8 = M2.5螺丝: Supplier Footprint: 插件
ZD4 = MMSZ5256B: 二极管配置:独立式;稳压值(标称值):30V;稳压值(范围):28.5V~31.5V;功率:350mW;精度:-;; Supplier Part: C21539; Manufacturer: CJ(江苏长电/长晶); Supplier Footprint: SOD-123; JLCPCB Part Class: Extended Part; Datasheet: https://atta.szlcsc.com/upload/public/pdf/source/20141125/1457707250015.pdf; Supplier: LCSC; Diode Configuration: 独立式; Zener Voltage (Nom): 30V; Reverse Leakage Current (Ir): 100nA@23V; Zener Voltage (Range): 28.5V~31.5V; Power Dissipation: 350mW; Zener Impedance (Zzt): 49Ω
C2-C5 C17-C20 = GRM31CR61E476ME44L: 容值:47uF;精度:±20%;额定电压:25V;材质(温度系数):X5R;; LCSC Part Name: 47uF ±20% 25V; Supplier Part: C403725; Manufacturer: muRata(村田); Supplier Footprint: 1206; JLCPCB Part Class: 扩展库; Datasheet: https://atta.szlcsc.com/upload/public/pdf/source/20191025/C403725_B8A8CD2FFA1F57E6FDF268BD106459D5.pdf; Supplier: LCSC; Tolerance: ±20%; Voltage Rated: 25V; Temperature Coefficient: X5R
D1-D3 = SS54_C22452: 直流反向耐压（Vr）:40V;平均整流电流（Io）:5A;正向压降（Vf）:550mV @ 5A;; Supplier Part: C22452; Manufacturer: MDD; Supplier Footprint: SMA(DO-214AC); JLCPCB Part Class: Basic Part; Supplier: LCSC
D5 = B5819W SL: 正向压降(Vf):600mV@1A;直流反向耐压(Vr):40V;平均整流电流(Io):1A;; LCSC Part Name: 电压:40V 电流:1A; Supplier Part: C8598; Manufacturer: CJ(江苏长电/长晶); Supplier Footprint: SOD-123; JLCPCB Part Class: Basic Part; Datasheet: https://atta.szlcsc.com/upload/public/pdf/source/20171228/C164911_15144413243851213914.pdf; Supplier: LCSC; Forward Voltage (Vf@If): 600mV@1A; Reverse Voltage (Vr): 40V; Average Rectified Current (Io): 1A
L1 = PSPMAA0402-220M-ANP: 电感值:22uH;精度:±20%;; LCSC Part Name: 22uH ±20%; Supplier Part: C5273842; Manufacturer: PROD(谱罗德); Supplier Footprint: SMD,4.1x4.5mm; JLCPCB Part Class: Extended Part; Datasheet: https://atta.szlcsc.com/upload/public/pdf/source/20221202/45A47065629BCCCB579E63BCAC56F0E1.pdf; Supplier: LCSC; Tolerance: ±20%
L2 L4 = SDFL1608S100KTF: 电感值:10uH;精度:±10%;额定电流:3mA;饱和电流(Isat):-;直流电阻(DCR):1.85Ω;; LCSC Part Name: 10uH ±10%; Supplier Part: C1035; Manufacturer: Sunlord(顺络); Supplier Footprint: 0603; JLCPCB Part Class: 基础库; Datasheet: https://atta.szlcsc.com/upload/public/pdf/source/20231027/097A17DDB71564CE812E62F0F80142C9.pdf; Supplier: LCSC; Tolerance: ±10%; Rated Current: 3mA; DC Resistance (DCR): 1.85Ω; Q @ Freq: 30@2MHz; Frequency - Self Resonant: 17MHz
L3 = SWPA252012S100MT: 电感值:10uH;精度:±20%;额定电流:620mA;饱和电流(Isat):880mA;类型:-;; LCSC Part Name: 10uH ±20% 880mA; Supplier Part: C37428; Manufacturer: Sunlord(顺络); Supplier Footprint: 1008; JLCPCB Part Class: 扩展库; Datasheet: https://atta.szlcsc.com/upload/public/pdf/source/20231024/317626D2AA2F8AB4113C1875E432E6E1.pdf; Supplier: LCSC; Tolerance: ±20%; Rated Current: 620mA; Saturation Current (Isat): 880mA; DC Resistance (DCR): 690mΩ
Q1 Q3 Q5 = AO3401A_C347476: Supplier Part: C347476; Manufacturer: UMW(广东友台半导体); Supplier Footprint: SOT-23; JLCPCB Part Class: 扩展库; Datasheet: https://atta.szlcsc.com/upload/public/pdf/source/20190827/C347476_6CCC01FEC3E3D166C83BA0E415FD2056.pdf; Supplier: LCSC
R1 = PTFR0603B120KP9: 电阻类型:薄膜电阻;阻值:120kΩ;精度:±0.1%;功率:100mW;最大工作电压:100V;温度系数:±25ppm/℃;; LCSC Part Name: 薄膜电阻 120kΩ ±0.1% 100mW; Supplier Part: C351687; Manufacturer: RESI(开步睿思）; Supplier Footprint: 0603; JLCPCB Part Class: Extended Part; Datasheet: https://atta.szlcsc.com/upload/public/pdf/source/20231020/37F75D505DFC5CA75CC16B0F0ECD8764.pdf; Supplier: LCSC; Type: 薄膜电阻; Tolerance: ±0.1%; Power(Watts): 100mW; Overload Voltage (Max): 100V; Temperature Coefficient: ±25ppm/℃; Operating Temperature Range: -55℃~+125℃
R2 R11 R16 = RC0603FR-07100RL: 电阻类型:厚膜电阻;阻值:100Ω;精度:±1%;功率:100mW;; LCSC Part Name: 100Ω ±1% 100mW; Supplier Part: C105588; Manufacturer: YAGEO(国巨); Supplier Footprint: 0603; JLCPCB Part Class: 扩展库; Datasheet: https://atta.szlcsc.com/upload/public/pdf/source/20170428/1493376742308.pdf; Supplier: LCSC; Type: 厚膜电阻; Tolerance: ±1%; Power(Watts): 100mW; Temperature Coefficient: ±100ppm/℃; Overload Voltage (Max): 75V; Operating Temperature Range: -55℃~+155℃
R4 = PTFR0603B15K0P9: 电阻类型:薄膜电阻;阻值:15kΩ;精度:±0.1%;功率:100mW;最大工作电压:100V;温度系数:±25ppm/℃;; LCSC Part Name: 薄膜电阻 15kΩ ±0.1% 100mW; Supplier Part: C478879; Manufacturer: RESI(开步睿思）; Supplier Footprint: 0603; JLCPCB Part Class: 扩展库; Datasheet: https://atta.szlcsc.com/upload/public/pdf/source/20231020/37F75D505DFC5CA75CC16B0F0ECD8764.pdf; Supplier: LCSC; Type: 薄膜电阻; Tolerance: ±0.1%; Power(Watts): 100mW; Overload Voltage (Max): 100V; Temperature Coefficient: ±25ppm/℃; Operating Temperature Range: -55℃~+125℃
R7 R15 = 0603WAF2001T5E: 阻值:2kΩ;精度:±1%;功率:100mW;温度系数:±100ppm/℃;电阻类型:厚膜电阻;; LCSC Part Name: 2kΩ ±1% 100mW 厚膜电阻; Supplier Part: C22975; Manufacturer: UNI-ROYAL(厚声); Supplier Footprint: 0603; JLCPCB Part Class: Basic Part; Datasheet: https://atta.szlcsc.com/upload/public/pdf/source/20200306/C422600_1E6D84923E4A46A82E41ADD87F860B5C.pdf; Supplier: LCSC; Tolerance: ±1%; Power(Watts): 100mW; Overload Voltage (Max): 75V; Temperature Coefficient: ±100ppm/℃; Type: 厚膜电阻; Operating Temperature Range: -55℃~+155℃
R10 = 0603WAF8202T5E: 电阻类型:厚膜电阻;阻值:82kΩ;精度:±1%;功率:100mW;最大工作电压:75V;温度系数:±100ppm/℃;; LCSC Part Name: 82kΩ ±1% 100mW 厚膜电阻; Supplier Part: C23254; Manufacturer: UNI-ROYAL(厚声); Supplier Footprint: 0603; JLCPCB Part Class: Basic Part; Datasheet: https://atta.szlcsc.com/upload/public/pdf/source/20200306/C422600_1E6D84923E4A46A82E41ADD87F860B5C.pdf; Supplier: LCSC; Type: 厚膜电阻; Tolerance: ±1%; Power(Watts): 100mW; Overload Voltage (Max): 75V; Temperature Coefficient: ±100ppm/℃; Operating Temperature Range: -55℃~+155℃
R12 = 0603WAF1602T5E: 电阻类型:厚膜电阻;阻值:16kΩ;精度:±1%;功率:100mW;最大工作电压:75V;温度系数:±100ppm/℃;; LCSC Part Name: 16kΩ ±1% 100mW 厚膜电阻; Supplier Part: C4210; Manufacturer: UNI-ROYAL(厚声); Supplier Footprint: 0603; JLCPCB Part Class: Extended Part; Datasheet: https://atta.szlcsc.com/upload/public/pdf/source/20200306/C422600_1E6D84923E4A46A82E41ADD87F860B5C.pdf; Supplier: LCSC; Type: 厚膜电阻; Tolerance: ±1%; Power(Watts): 100mW; Overload Voltage (Max): 75V; Temperature Coefficient: ±100ppm/℃; Operating Temperature Range: -55℃~+155℃
U1 = LMR14050SDDAR: 功能类型:降压型;输出类型:可调;输入电压:4V~40V;输出电压:800mV~28V;输出电流(最大值):5A;; Supplier Part: C155484; Manufacturer: TI(德州仪器); Supplier Footprint: SOP-8-EP; JLCPCB Part Class: 扩展库; Datasheet: https://www.ti.com/cn/lit/gpn/lmr14050; Supplier: LCSC; Function: 降压型; Synchronous Rectification: 否; Output Type: 可调; Number of Outputs: 1; Topology: 降压式; Input Voltage: 4V~40V; Output Voltage: 800mV~28V; Output Current (Max): 5A; Switching Frequency: 2.5MHz; Operating Temperature: -40℃~+125℃@(TJ)
U2 = LGS5145: 功能类型:降压型;输出类型:可调;输入电压:4.5V~55V;输出电压:800mV~40V;输出电流(最大值):1A;; Supplier Part: C5123971; Manufacturer: Legend-Si(棱晶半导体); Supplier Footprint: SOT-23-6; JLCPCB Part Class: 扩展库; Datasheet: https://atta.szlcsc.com/upload/public/pdf/source/20230407/AF0D76B6B755358F740E4FC32952FD3E.pdf; Supplier: LCSC; Function: 降压型; Output Type: 可调; Input Voltage: 4.5V~55V; Output Voltage: 800mV~40V; Output Current (Max): 1A; Switching Frequency: 1.2MHz; Operating Temperature: -40℃~+125℃@(TJ); Synchronous Rectification: 否; Number of Outputs: 1; Topology: 降压式; Quiescent Current (Iq): 150uA; Switch tube (built-in/external): 内置
U3 = SSP7903P33PR: 最大输入电压:40V;输出电压:3.3V;最大输出电流:1A;电源纹波抑制比(PSRR):73.2dB@(10Hz);输出极性:正极;; Supplier Part: C2965586; Manufacturer: Siproin(上海矽朋); Supplier Footprint: SOT-89-3; JLCPCB Part Class: 扩展库; Datasheet: https://atta.szlcsc.com/upload/public/pdf/source/20231026/C9DC5668D914F4F12A37EC04B80DC6E1.pdf; Supplier: LCSC; Maximum Input Voltage: 40V; Output Voltage: 3.3V; MAX Output Current: 1A; Power Supply Rejection Ratio (PSRR): 73.2dB@(10Hz); Dropout Voltage: 20mV; standby current: 1.6uA; Operating Temperature: -40℃~+85℃; Output Polarity: 正极; Number of Outputs: 1
ZD1 = MMSZ5246B_C21544: 二极管配置:独立式;稳压值(标称值):16V;稳压值(范围):15.2V~16.8V;功率:350mW;精度:-;; Supplier Part: C21544; Manufacturer: CJ(江苏长电/长晶); Supplier Footprint: SOD-123; JLCPCB Part Class: Extended Part; Datasheet: https://atta.szlcsc.com/upload/public/pdf/source/20141125/1457707250015.pdf; Supplier: LCSC; Diode Configuration: 独立式; Zener Voltage (Nom): 16V; Reverse Leakage Current (Ir): 100nA@12V; Zener Voltage (Range): 15.2V~16.8V; Power Dissipation: 350mW; Zener Impedance (Zzt): 17Ω
ZD2 = MMSZ5232B_C21554: 二极管配置:独立式;稳压值(标称值):5.6V;稳压值(范围):5.32V~5.88V;功率:350mW;精度:-;; Supplier Part: C21554; Manufacturer: CJ(江苏长电/长晶); Supplier Footprint: SOD-123; JLCPCB Part Class: Extended Part; Datasheet: https://atta.szlcsc.com/upload/public/pdf/source/20141125/1457707250015.pdf; Supplier: LCSC; Diode Configuration: 独立式; Zener Voltage (Nom): 5.6V; Reverse Leakage Current (Ir): 5uA@3V; Zener Voltage (Range): 5.32V~5.88V; Power Dissipation: 350mW; Zener Impedance (Zzt): 11Ω
ZD3 = MMSZ5228B: 二极管配置:独立式;稳压值(标称值):3.9V;稳压值(范围):3.71V~4.1V;功率:350mW;精度:-;; Supplier Part: C21551; Manufacturer: CJ(江苏长电/长晶); Supplier Footprint: SOD-123; JLCPCB Part Class: Extended Part; Datasheet: https://atta.szlcsc.com/upload/public/pdf/source/20141125/1457707250015.pdf; Supplier: LCSC; Diode Configuration: 独立式; Zener Voltage (Nom): 3.9V; Reverse Leakage Current (Ir): 10uA@1V; Zener Voltage (Range): 3.71V~4.1V; Power Dissipation: 350mW; Zener Impedance (Zzt): 23Ω

## Nets
3V3: C23.1 C24.2 Q5.2(S) Q6.2(E) R16.2 U3.3(VOUT)
+5V: C21.1 C22.2 LED3.2(A) Q3.3(D) U3.2(VIN) ; also on sheet 7
+6.7V: C29.2 C30.2 C31.1 LED1.2(A) Q1.3(D) U17.29(EXTVCC)
AGND: C2.1 C3.1 C4.1 C5.1 C6.2 C7.1 C8.1 C9.1 C10.2 C11.1 C12.1 C13.1 C14.1 C15.1 C17.1 C18.1 C19.1 C20.1 C21.2 C22.1 C23.2 C24.1 C25.2 C26.1 C27.1 C28.2 C29.1 C30.1 C31.2 C32.2 C33.1 C34.1 C35.1 C36.1 C37.1 C38.1 C39.2 C40.2 C41.2 C42.1 C43.1 C44.1 C45.1 C46.1 C47.2 C48.2 C49.2 C50.2 C51.2 C52.2 C53.2 C54.2 C55.2 C56.2 C57.2 C58.1 C59.1 C60.1 C61.1 C62.1 C63.1 C64.1 C65.1 C66.1 C67.1 C68.2 C77.2 C131.2 C132.1 C133.1 CN1.2 CN2.2 D1.1(A) D4.2(A) D5.2(+) D8.2(A) D9.2(A) D10.2(A) D11.2(A) D16.2(A) Q17.1(S) Q17.2(S) Q17.3(S) R3.1 R4.1 R6.2 R7.1 R9.1 R12.1 R14.2 R15.1 R18.2 R19.1 R23.1 R24.1 R26.1 R28.1 R30.1 R40.1 R48.1 TP1.1 TP2.1 TP3.1 TP4.1 TP5.1 TP6.1 TP7.1 TP8.1 U1.7(GND) U1.9(EP) U2.2(GND) U3.1(VSS) U17.14(SYNC) U17.15(GND) U17.37(MODE) U17.41(GND) ZD1.2(A) ZD2.2(A) ZD3.2(A) ; also on sheet 4 5 6 7 8
AVCC: C26.2 L4.2 LED4.2(A) ; also on sheet 5 6 7 8
VCC: C25.1 L4.1 Q5.3(D) ; also on sheet 7 8
VIN: C41.1 C42.2 C43.2 C44.2 C45.2 C46.2 C47.1 C50.1 C51.1 C60.2 C61.2 D2.1(A) D12.3(K) Q7.5(D) Q7.6(D) Q7.7(D) Q7.8(D) R29.1 R31.2 R33.2 ; also on sheet 4 5
5: C17.2 C18.2 C19.2 C20.2 L3.2 Q3.2(S) Q4.2(E) R10.2 R11.2
6.7: C2.2 C3.2 C4.2 C5.2 L1.2 Q1.2(S) Q2.2(E) R1.2 R2.2 ; also on sheet 8
+24: C7.2 C8.2 C9.2 C12.2 C13.2 C14.2 C15.2 C27.2 C28.1 C133.2 D4.1(C) L2.2 LED2.2(A) R8.2 R20.2 U1.2(VIN) U1.3(EN) U2.4(EN) U2.5(VIN) U17.34(VINCHIP)
BG1: Q13.2(K) R39.1 U17.16(BG1)
BG2: Q14.2(K) R41.2 U17.18(BG2)
BOOST1: C73.2 D6.3 U17.24(BOOST1)
BOOST2: C74.2 D7.3 U17.19(BOOST2)
CAP: C54.1 C55.1 C56.1 C57.1 C64.2 C65.2 C66.2 C67.2 C68.1 CN2.1 D3.1(A) D11.1(C) LED5.2(A) R32.1 ; also on sheet 4 5 8
CELL: C48.1 C49.1 C58.2 C59.2 Q15.3(D) R31.1 R45.2 ; also on sheet 4 5
CELL_IN: CN3.1 Q15.2(S) Q16.2(E) R42.2 R43.1 R44.1
CHASSIS: C39.1 C40.1 CN1.1 D8.1(C) D9.1(C) D10.1(C) R29.2 ; also on sheet 5
CLKOUT: U17.1(CLKOUT) ; also on sheet 7
CS+: C71.1 C72.1 D14.1(A) D14.2(A) D15.1(A) D15.2(A) Q11.1(S) Q11.2(S) Q11.3(S) Q12.1(S) Q12.2(S) Q12.3(S) R40.2 ; also on sheet 4
CSOUT+: C52.1 C53.1 C62.2 C63.2 D13.3(K) Q8.5(D) Q8.6(D) Q8.7(D) Q8.8(D) R32.2 R34.2 ; also on sheet 4 5 7
DIR: R21.2 U17.7(DIR)
GATE_BG1: Q11.4(G) Q13.1(A) R39.2
GATE_BG2: Q12.4(G) Q14.1(A) R41.1
GATE_TG1: Q7.4(G) Q9.1(A) R35.2
GATE_TG2: Q8.4(G) Q10.1(A) R36.1
GATEVCC: C32.1 C33.2 R117.1 U17.17(GATEVCC) U17.35(INTVCC)
ICN: C34.2 R23.2 U17.6(ICN)
ICP: C35.2 R24.2 U17.28(ICP)
LDO33: C131.1 C132.2 R21.1 R22.2 R25.2 U17.40(LDO33) ; also on sheet 4
RT: R28.2 U17.13(RT)
RVSOFF: R25.1 U17.25(RVSOFF#) ; also on sheet 7
SHDN: R20.1 R26.2 U17.3(SHDN#)
SS: C36.2 U17.2(SS)
SW1: C69.1 C73.1 D12.1(A) D12.2(A) D14.3(K) L5.2 Q7.1(S) Q7.2(S) Q7.3(S) Q11.5(D) Q11.6(D) Q11.7(D) Q11.8(D) R37.2 U17.22(SW1)
SW2: C70.1 C74.1 D13.1(A) D13.2(A) D15.3(K) L5.1 Q8.1(S) Q8.2(S) Q8.3(S) Q12.5(D) Q12.6(D) Q12.7(D) Q12.8(D) R38.2 U17.21(SW2)
SWEN: R22.1 U17.36(SWEN) ; also on sheet 7
TG1: Q9.2(K) R35.1 U17.23(TG1)
TG2: Q10.2(K) R36.2 U17.20(TG2)
VC: C37.2 R27.2 U17.10(VC)
$1N2921: R3.2 U1.4(RT/SYNC)
$1N2923: C1.2 D1.2(K) L1.1 U1.8(SW)
$1N2924: C10.1 U1.6(SS)
$1N2925: R1.1 R4.2 U1.5(FB)
$1N2934: R16.1 R17.1 ZD3.1(K)
$1N2935: Q6.1(B) R17.2
$1N2936: Q5.1(G) Q6.3(C) R18.1
$1N2942: R11.1 R13.1 ZD2.1(K)
$1N2943: Q4.1(B) R13.2
$1N2944: Q3.1(G) Q4.3(C) R14.1
$1N2946: LED3.1(K) R15.2
$1N2950: R2.1 R5.1 ZD1.1(K)
$1N2951: Q2.1(B) R5.2
$1N2952: Q1.1(G) Q2.3(C) R6.1
$1N5455: C16.2 D5.1(-) L3.1 U2.6(SW)
$1N5462: C16.1 U2.1(BST)
$1N5819: R10.1 R12.2 U2.3(FB)
$1N20152: LED2.1(K) R9.2
$1N20304: LED1.1(K) R7.2
$1N20489: C1.1 U1.1(BOOT)
$1N21680: C11.2 D2.2(K) D3.2(K) L2.1
$1N23777: C6.1 R8.1
$1N56967: LED4.1(K) R19.2
$2N1373: C38.2 R27.1
$2N3980: D6.1 D6.2 D7.1 D7.2 R117.2
$3N2105: C76.1 R42.1
$3N2106: C77.1 R45.1
$3N2107: R44.2 R46.1 ZD4.1(K)
$3N2108: C75.2 Q16.1(B) R46.2
$3N2111: C75.1 Q16.3(C) R47.1 R48.2
$3N2122: D16.1(K) Q17.4(G) R43.2
$3N2123: C76.2 CN3.2 Q17.5(D) Q17.6(D) Q17.7(D) Q17.8(D) ZD4.2(A)
$3N10641: Q15.1(G) R47.2
$3N44714: C69.2 R33.1
$3N44716: C70.2 R34.1
$3N44737: C71.2 R37.1
$3N44780: C72.2 R38.1
$3N62837: LED5.1(K) R30.2

## Notes on the sheets
sheet 3
- 封装
- MTP2918E-3R3M-H
- 缓启动
